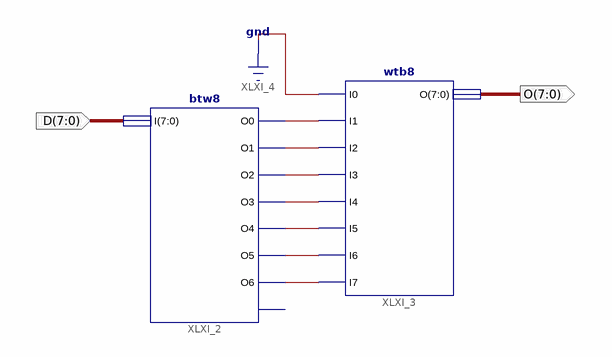
[diagram p0: schematic sheet 1]
// Xilinx ISE schematic shl8.sch (spartan6) as structural Verilog: 2 symbols, 2 ports
module shl8 (
  input  [7:0] D,
  output [7:0] O
);

  wire XLXN_11, XLXN_12, XLXN_13, XLXN_14, XLXN_15, XLXN_16, XLXN_17;

  btw8 XLXI_2 (
    .I(D), .O0(XLXN_11), .O1(XLXN_12), .O2(XLXN_13), .O3(XLXN_14), .O4(XLXN_15), .O5(XLXN_16), .O6(XLXN_17));  // open: O7
  wtb8 XLXI_3 (
    .I0(1'b0), .I1(XLXN_11), .I2(XLXN_12), .I3(XLXN_13), .I4(XLXN_14), .I5(XLXN_15), .I6(XLXN_16),
    .I7(XLXN_17), .O(O));
endmodule
